# EAGLE board TiNRS&Navenant-Overstuurd versie 1 (EAGLE 9.5.1), part 1 of 3
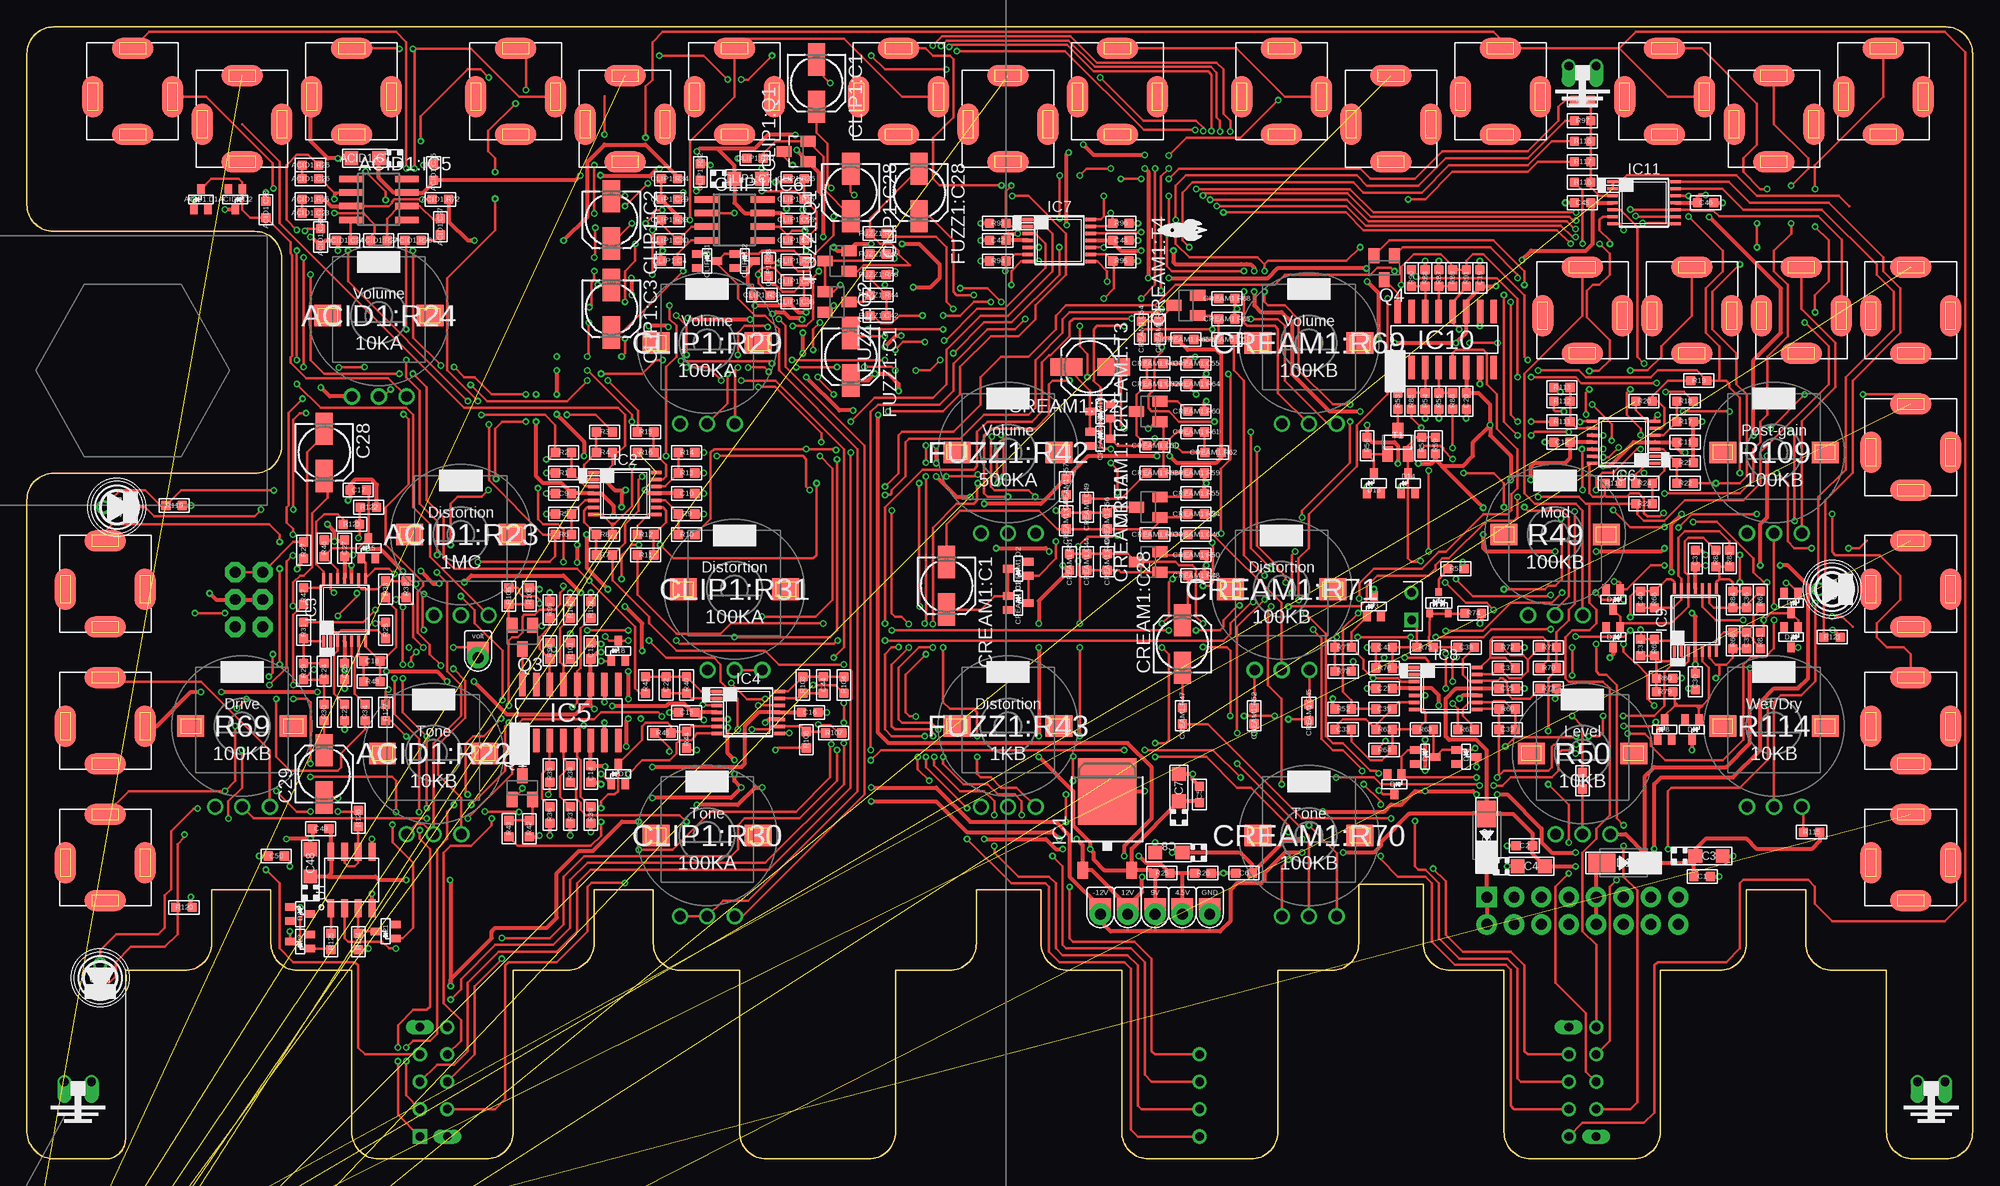
[diagram p11: board, top side]
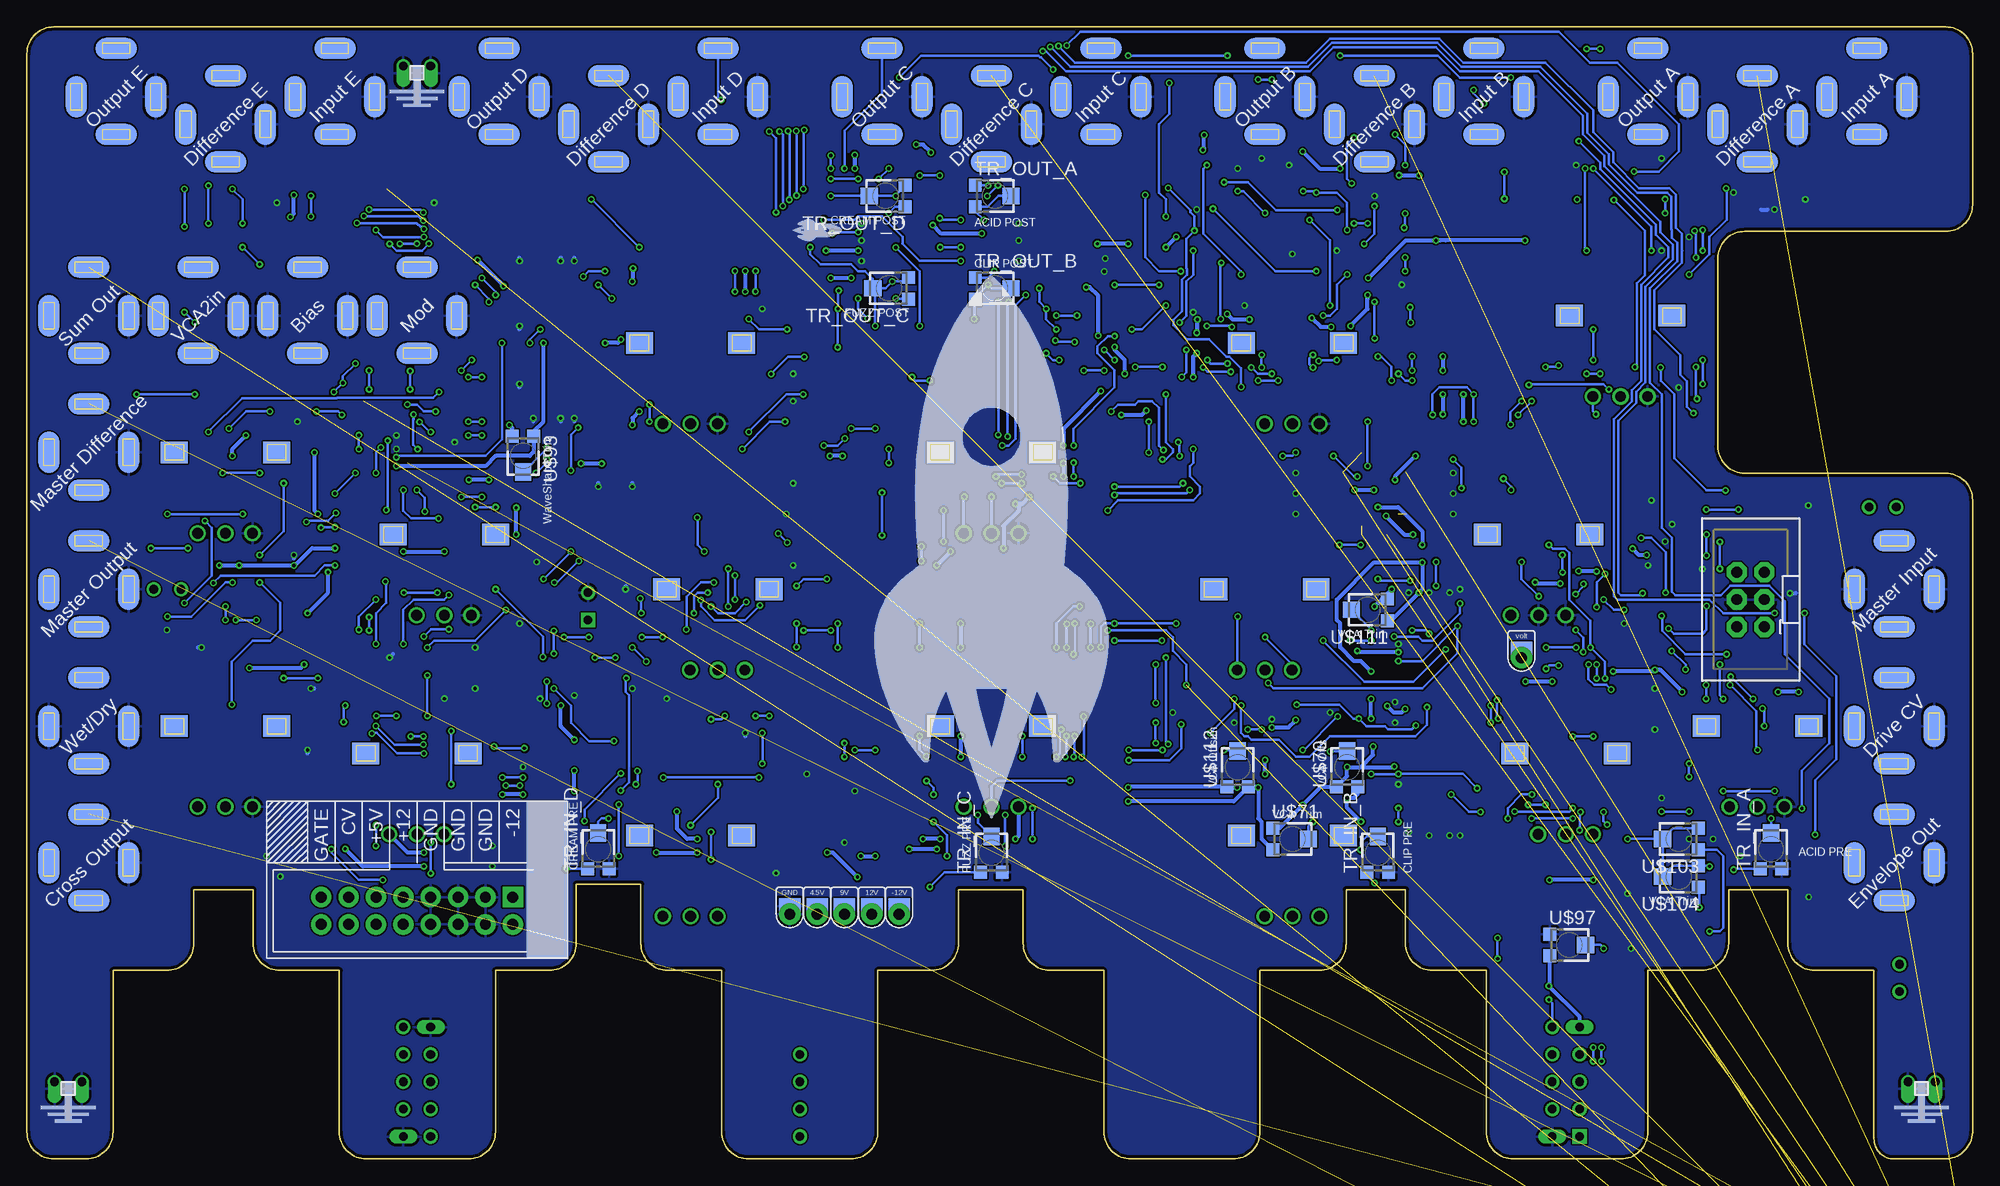
[diagram p12: board, bottom side, seen from below]

Size 180.66 x 105.08 mm. Coordinates in mm from the lower left corner, seen from the top.
Copper layers (1*16): Top 0.035mm / dielectric 1.5mm / Bottom 0.035mm
Design rules "ITeadstudio": minimum track width 6mil, minimum drill 12mil, track to track 6mil, track to pad 6mil, pad to pad 6mil, via to via 6mil, smd to smd 0mil, copper to edge 10mil, drill to drill 10mil, minimum pad ring 10mil, minimum via ring 6mil, stop-mask expansion 2mil, vias tented up to drill 100mil, thermal gap 10mil
Net classes: 0 default: width 0.254 mm; 1 power: width 0.381 mm

## Footprints (pad centres in the part's own frame; a part is rotated, then mirrored left to right if it is on the bottom)
CASE-A_3216 = smd 1.27 x 1.27: + -1.27,0; - 1.27,0
C0603 = smd 0.889 x 0.889: 1 -0.762,0; 2 0.762,0
SOT-323 = smd 0.7 x 0.9: ANODE -0.65,-0.95; CATHODE 0,0.95; NC 0.65,-0.95
SO08 = smd 0.6 x 2.2: 1 -1.905,-2.6; 2 -0.635,-2.6; 3 0.635,-2.6; 4 1.905,-2.6; 5 1.905,2.6; 6 0.635,2.6; 7 -0.635,2.6; 8 -1.905,2.6
ALPS_POT_SQUAREHOLES = drill 1: P$1 -2.5,-7.5; P$2 0,-7.5; P$3 2.58,-7.5 | smd 2.5 x 2: P$4 -4.75,0; P$5 4.75,0 | smd 2.5 x 2 bottom: P$6 -4.75,0; P$7 4.75,0
R0603 = smd 0.889 x 0.889: 1 -0.762,0; 2 0.762,0
153CLV-0505 = smd 3 x 1.6: + 2.2,0; - -2.2,0
SOT23 = smd 1 x 1.4: 1 -0.95,-1.1; 2 0.95,-1.1; 3 0,1.1
SOT23-BEC = smd 1 x 1.4: B -0.95,-1.1; C 0,1.1; E 0.95,-1.1
DO-214AC = smd 2.5 x 1.7: 1 -2,0; 2 2,0
3MMLED = drill 0.8: + -1.27,0; - 1.27,0
TO252 = smd 1 x 1.6: 1 -2.28,-4.8; 2 2.28,-4.8 | smd 5.4 x 6.2: 3 0,2.5
TSSOP14 = smd 0.305 x 0.991: 1 -1.95,-2.918; 2 -1.3,-2.918; 3 -0.65,-2.918; 4 0,-2.918; 5 0.65,-2.918; 6 1.3,-2.918; 7 1.95,-2.918; 8 1.95,2.918; 9 1.3,2.918; 10 0.65,2.918; 11 0,2.918; 12 -0.65,2.918; 13 -1.3,2.918; 14 -1.95,2.918
SO16 = smd 0.6 x 2.2: 1 -4.445,-2.6; 2 -3.175,-2.6; 3 -1.905,-2.6; 4 -0.635,-2.6; 5 0.635,-2.6; 6 1.905,-2.6; 7 3.175,-2.6; 8 4.445,-2.6; 9 4.445,2.6; 10 3.175,2.6; 11 1.905,2.6; 12 0.635,2.6; 13 -0.635,2.6; 14 -1.905,2.6; 15 -3.175,2.6; 16 -4.445,2.6
3.5MM-JACK-SWITCH-13MM-NOHOLES = smd 1.95 x 3.85 bottom: RING_B@1 -3.7,0; SWITCH_B@1 3.7,0 | smd 1.95 x 3.85: RING_T@3 -3.7,0; SWITCH_T@3 3.7,0 | smd 3.85 x 1.95 bottom: SECOND_B@1 0,-3.5; TIP_B@1 0,4.5 | smd 3.85 x 1.95: SECOND_T@3 0,-3.5; TIP_T@3 0,4.5
POWER_16_SHROUDED = drill 1.016 pad 1.88 square: 1 -8.89,-1.27 | drill 1.016 pad 1.88: 2 -8.89,1.27; 3 -6.35,-1.27; 4 -6.35,1.27; 5 -3.81,-1.27; 6 -3.81,1.27; 7 -1.27,-1.27; 8 -1.27,1.27; 9 1.27,-1.27; 10 1.27,1.27; 11 3.81,-1.27; 12 3.81,1.27; 13 6.35,-1.27; 14 6.35,1.27; 15 8.89,-1.27; 16 8.89,1.27
TC33X = smd 1.2 x 1.2: 1 -1,-1.825; 3 1,-1.825 | smd 1.5 x 1.6: 2 0,1.5
SOIC8 = smd 1.651 x 0.635: 1 -2.616,1.905; 2 -2.616,0.635; 3 -2.616,-0.635; 4 -2.616,-1.905; 5 2.616,-1.905; 6 2.616,-0.635; 7 2.616,0.635; 8 2.616,1.905
POWERTESTPAD = drill 1 pad 2: P$1 0,0 | smd 2 x 1.5: P$2 0,-0.75 | smd 2 x 1.5 bottom: P$3 0,-0.75
BYPASSBOARD = drill 0.8 long: 12V 31.75,15.24; GND 34.29,5.08; GND2 138.43,15.24; GND3 140.97,5.08 | drill 0.8 square: P$1 31.75,5.08 | drill 0.8: P$2 31.75,10.16; P$3 31.75,7.62; P$4 31.75,12.7; P$5 34.29,15.24; P$6 34.29,10.16; P$7 34.29,12.7; P$8 34.29,7.62; P$9 104.14,5.08; P$10 104.14,10.16; P$11 104.14,7.62; P$12 104.14,12.7; P$13 138.43,5.08; P$14 138.43,10.16; P$15 138.43,7.62; P$16 138.43,12.7; P$17 140.97,15.24; P$18 140.97,10.16; P$19 140.97,12.7; P$20 140.97,7.62
GROUNDLOOP = drill 0.8 offset: P$1 1.27,0; P$2 -1.27,0
2X3-SHROUDED = drill 1.016 pad 1.88 octagon: 1 -1.27,2.54; 2 1.27,2.54; 3 -1.27,0; 4 1.27,0; 5 -1.27,-2.54; 6 1.27,-2.54
SOT23' = smd 0.6 x 0.7: P$1 -0.85,-1; P$2 0.85,-1; P$3 0,1
TESTPAD_DUAL_PTH = drill 0.8 square: P$1 -1.27,0 | drill 0.8: P$2 1.27,0

## Placement (x,y rotation side)
ACID1:C7  10uF  [CASE-A_3216]  31.41,92.89 180 top
ACID1:C22  1nF  [C0603]  27.28,85.58 270 top
ACID1:C23  10nF  [C0603]  26.33,87.81 180 top
ACID1:C24  100n  [C0603]  29.5,85.27 180 top
ACID1:C25  100n  [C0603]  37.76,91.61 90 top
ACID1:C26  47nF  [C0603]  26.33,90.98 0 top
ACID1:C27  1uF  [C0603]  38.39,86.53 270 top
ACID1:C28  1nF  [C0603]  22.2,88.12 270 top
ACID1:D1  BAS16W  [SOT-323]  16.17,89.08 0 top
ACID1:D2  BAS16W  [SOT-323]  19.34,89.08 180 top
ACID1:IC5  UA741D  [SO08]  32.68,89.08 270 top
ACID1:R22  10KB  [ALPS_POT_SQUAREHOLES]  37.76,37.64 0 top
ACID1:R23  1MC  [ALPS_POT_SQUAREHOLES]  40.3,57.96 0 top
ACID1:R24  10KA  [ALPS_POT_SQUAREHOLES]  32.68,78.28 0 top
ACID1:R25  10K  [R0603]  26.33,89.08 180 top
ACID1:R26  4.7K  [R0603]  26.33,92.25 0 top
ACID1:R27  1M  [R0603]  32.68,85.27 0 top
ACID1:R28  5.6K  [R0603]  35.85,85.27 0 top
ACID1:R72  1M  [R0603]  38.39,89.08 0 top
C1  100n  [C0603]  155.55,26.21 180 top
C2  100n  [C0603]  139.04,29.07 180 top
C3  10u  [CASE-A_3216]  156.18,28.11 0 top
C4  10u  [CASE-A_3216]  139.67,27.16 0 top
C5  100n  [C0603]  108.88,33.83 270 top
C6  100n  [C0603]  113,26.53 0 top
C7  10u  [CASE-A_3216]  106.97,34.47 90 top
C8  10u  [CASE-A_3216]  106.02,28.43 180 top
C9  100n  [C0603]  49.82,61.77 0 top
C10  100n  [C0603]  61.25,61.77 0 top
C11  100n  [C0603]  153.96,66.53 180 top
C12  100n  [C0603]  142.53,66.53 180 top
C13  100n  [C0603]  52.36,47.16 270 top
C14  100n  [C0603]  52.36,35.73 270 top
C15  100n  [C0603]  61.25,41.45 0 top
C16  100n  [C0603]  72.68,41.45 0 top
C17  100nF  [C0603]  30.77,62.09 0 top
C18  10pF  [C0603]  32.04,46.21 0 top
C19  100n  [C0603]  134.91,81.77 270 top
C20  100n  [C0603]  133.64,70.34 270 top
C21  100n  [C0603]  126.02,43.67 0 top
C22  10pF  [C0603]  59.35,43.99 90 top
C23  10pF  [C0603]  29.5,41.45 90 top
C24  47pF  [C0603]  27.6,45.26 270 top
C25  100n  [C0603]  137.45,43.67 0 top
C26  100n  [C0603]  29.5,45.26 90 top
C27  100n  [C0603]  29.5,56.69 90 top
C28  10uF  [153CLV-0505]  27.6,65.58 270 top
C29  10uF  [153CLV-0505]  27.6,35.73 90 top
C30  100n  [C0603]  154.91,44.31 90 top
C31  100n  [C0603]  154.91,55.74 90 top
C32  33p  [C0603]  137.45,39.86 0 top
C33  220p  [C0603]  122.21,39.86 180 top
C34  33p  [C0603]  149.83,47.48 90 top
C35  33p  [C0603]  159.68,48.12 270 top
C36  33p  [C0603]  159.68,51.93 270 top
C37  33p  [C0603]  137.45,45.58 180 top
C38  100n  [C0603]  133.64,47.48 180 top
C39  680n  [C0603]  126.02,41.77 0 top
C40  33p FIX  [C0603]  149.83,51.93 270 top
C41  33p FIX  [C0603]  126.02,47.48 180 top
C42  100n  [C0603]  90.14,85.27 0 top
C43  100n  [C0603]  101.57,85.27 0 top
C44  10pF  [C0603]  73.95,43.99 90 top
C45  100n  [C0603]  144.44,88.76 0 top
C46  100n  [C0603]  155.87,88.76 0 top
C48  10u  [CASE-A_3216]  26.33,27.48 90 top
C49  100n  [C0603]  27.28,30.66 0 top
C50  22uF  [C0603]  23.15,28.11 0 top
CLIP1:C1  4.7uF  [153CLV-0505]  73.32,99.87 270 top
CLIP1:C2  2.2uF  [153CLV-0505]  54.27,87.17 270 top
CLIP1:C3  4.7uF  [153CLV-0505]  54.27,78.92 270 top
CLIP1:C4  100n  [C0603]  59.66,83.36 180 top
CLIP1:C7  10uF  [CASE-A_3216]  66.97,90.98 0 top
CLIP1:C25  100n  [C0603]  71.41,87.17 0 top
CLIP1:C28  1uF  [153CLV-0505]  76.49,89.71 270 top
CLIP1:C29  22nF  [C0603]  59.66,89.08 180 top
CLIP1:C30  1nF  [C0603]  59.66,85.27 0 top
CLIP1:C31  100pF  [C0603]  71.41,85.27 180 top
CLIP1:C35  3.3nF  [C0603]  71.41,79.55 180 top
CLIP1:C36  22nF  [C0603]  71.41,81.45 180 top
CLIP1:D1  BAS16W  [SOT-323]  63.16,83.36 270 top
CLIP1:D2  BAS16W  [SOT-323]  66.65,83.36 270 top
CLIP1:IC6  UA741D  [SO08]  65.7,87.17 270 top
CLIP1:Q1  SST201  [SOT23]  71.41,93.52 90 top
CLIP1:R29  100KA  [ALPS_POT_SQUAREHOLES]  63.16,75.74 0 top
CLIP1:R30  100KA  [ALPS_POT_SQUAREHOLES]  63.16,30.02 0 top
CLIP1:R31  100KA  [ALPS_POT_SQUAREHOLES]  65.7,52.88 0 top
CLIP1:R32  1M  [R0603]  62.52,91.61 90 top
CLIP1:R33  1K  [R0603]  59.66,87.17 180 top
CLIP1:R34  1M  [R0603]  59.66,90.98 0 top
CLIP1:R35  560R  [R0603]  71.41,89.08 0 top
CLIP1:R36  47R  [R0603]  71.41,90.98 0 top
CLIP1:R37  1K  [R0603]  71.41,83.36 0 top
CLIP1:R38  1.5K  [R0603]  68.87,82.72 270 top
CLIP1:R39  1M  [R0603]  68.24,80.19 0 top
CLIP1:R40  10K  [R0603]  67.6,92.89 0 top
CREAM1:C1  1uF  [153CLV-0505]  85.38,53.2 270 top
CREAM1:C2  1uF  [153CLV-0505]  98.72,73.52 180 top
CREAM1:C28  1uF  [153CLV-0505]  107.29,47.8 90 top
CREAM1:C44  470pF  [C0603]  98.4,55.42 90 top
CREAM1:C45  1uF  [C0603]  119.04,41.45 90 top
CREAM1:C46  100nF  [C0603]  108.56,57.96 180 top
CREAM1:C47  470pF  [C0603]  96.49,59.23 90 top
CREAM1:C49  100nF  [C0603]  98.4,60.5 90 top
CREAM1:C50  470pF  [C0603]  104.75,66.22 180 top
CREAM1:C52  4nF  [C0603]  104.75,71.93 0 top
CREAM1:C53  100nF  [C0603]  111.42,76.06 180 top
CREAM1:C54  100nF  [C0603]  103.48,77.01 270 top
CREAM1:C55  10nF  [C0603]  108.56,73.83 180 top
CREAM1:D1  BAS16W  [SOT-323]  92.05,51.61 270 top
CREAM1:D2  BAS16W  [SOT-323]  92.05,54.78 90 top
CREAM1:D3  BAS16W  [SOT-323]  99.67,69.39 90 top
CREAM1:D4  BAS16W  [SOT-323]  99.67,66.85 270 top
CREAM1:R47  39K  [R0603]  107.29,41.13 90 top
CREAM1:R48  47K  [R0603]  108.56,54.15 180 top
CREAM1:R49  470K  [R0603]  100.3,55.42 270 top
CREAM1:R50  100R  [R0603]  108.56,56.05 0 top
CREAM1:R51  10K  [R0603]  96.81,55.42 90 top
CREAM1:R52  1K  [R0603]  113.96,41.13 270 top
CREAM1:R53  10K  [R0603]  104.75,57.96 180 top
CREAM1:R54  100K  [R0603]  108.56,59.87 180 top
CREAM1:R55  150R  [R0603]  108.56,61.77 180 top
CREAM1:R56  470K  [R0603]  100.3,59.23 270 top
CREAM1:R57  10K  [R0603]  96.49,62.41 270 top
CREAM1:R58  10K  [R0603]  104.75,63.67 0 top
CREAM1:R59  100K  [R0603]  108.56,63.67 180 top
CREAM1:R60  150R  [R0603]  108.56,69.39 180 top
CREAM1:R61  470K  [R0603]  108.56,67.48 180 top
CREAM1:R62  10K  [R0603]  110.15,65.58 180 top
CREAM1:R63  39K  [R0603]  104.75,73.83 0 top
CREAM1:R64  22K  [R0603]  108.56,71.93 0 top
CREAM1:R65  100K  [R0603]  111.42,77.96 180 top
CREAM1:R66  430K  [R0603]  107.61,76.06 180 top
CREAM1:R67  15K  [R0603]  105.07,77.01 270 top
CREAM1:R68  3.3K  [R0603]  111.42,79.87 180 top
CREAM1:R69  100KB  [ALPS_POT_SQUAREHOLES]  119.04,75.74 0 top
CREAM1:R70  100KB  [ALPS_POT_SQUAREHOLES]  119.04,30.02 0 top
CREAM1:R71  100KB  [ALPS_POT_SQUAREHOLES]  116.5,52.88 0 top
CREAM1:T1  2n3904  [SOT23-BEC]  104.11,55.42 90 top
CREAM1:T2  2n3904  [SOT23-BEC]  104.11,60.5 90 top
CREAM1:T3  2n3904  [SOT23-BEC]  104.11,69.39 90 top
CREAM1:T4  2n3904  [SOT23-BEC]  107.61,79.23 90 top
D1  1n4001  [DO-214AC]  148.25,27.48 0 top
D2  1n4001  [DO-214AC]  135.55,30.02 270 top
D3  BAS16W  [SOT-323]  125.07,51.29 0 top
D4  BAS16W  [SOT-323]  126.97,34.78 180 top
D5  BAS16W  [SOT-323]  133.64,37.32 270 top
D6  BAS16W  [SOT-323]  129.83,37.32 270 top
D7  BAS16W  [SOT-323]  154.6,39.86 180 top
D8  BAS16W  [SOT-323]  152.06,39.86 0 top
D9  BAS16W  [SOT-323]  163.8,51.61 180 top
D10  BAS16W  [SOT-323]  147.29,51.93 180 top
D11  BAS16W  [SOT-323]  147.29,48.44 180 top
D12  BAS16W  [SOT-323]  163.8,48.44 180 top
D13  BAS16W  [SOT-323]  125.07,62.72 0 top
D14  BAS16W  [SOT-323]  128.24,62.72 0 top
D15  BAS16W  [SOT-323]  31.72,56.69 0 top
D16  [3MMLED]  8.36,60.5 0 top
D17  BAS16W  [SOT-323]  54.9,35.73 0 top
D18  BAS16W  [SOT-323]  54.9,47.16 0 top
D19  [3MMLED]  6.8,16.8 270 top
D20  [3MMLED]  167.61,52.88 0 top
D21  BAS16W  [SOT-323]  33.31,21.13 90 top
D22  BAS16W  [SOT-323]  25.37,20.18 90 top
D23  BAS16W  [SOT-323]  25.37,22.72 270 top
FUZZ1:C1  20uF  [153CLV-0505]  76.49,74.47 270 top
FUZZ1:C28  2.2uF  [153CLV-0505]  82.84,89.71 270 top
FUZZ1:C42  10nF  [C0603]  79.03,78.28 180 top
FUZZ1:Q1  MMBT3906LT1SMD  [SOT23-BEC]  75.22,83.36 90 top
FUZZ1:Q2  MMBT3906LT1SMD  [SOT23-BEC]  75.22,79.55 270 top
FUZZ1:R41  100K  [R0603]  79.03,85.9 180 top
FUZZ1:R42  500KA  [ALPS_POT_SQUAREHOLES]  91.1,65.58 0 top
FUZZ1:R43  1KB  [ALPS_POT_SQUAREHOLES]  91.1,40.18 0 top
FUZZ1:R44  8.2K  [R0603]  79.03,80.19 180 top
FUZZ1:R45  33K  [R0603]  79.03,84 180 top
FUZZ1:R46  470R  [R0603]  79.03,82.09 180 top
IC1  7809DT  [TO252]  100.3,31.61 0 top
IC2  TL074TSSOP14  [TSSOP14]  55.54,61.77 270 top
IC3  TL074TSSOP14  [TSSOP14]  29.5,50.98 0 top
IC4  TL074TSSOP14  [TSSOP14]  66.97,41.45 270 top
IC5  LM13700M  [SO16]  50.46,41.45 0 top
IC6  TL074TSSOP14  [TSSOP14]  148.25,66.53 90 top
IC7  TL074TSSOP14  [TSSOP14]  95.86,85.27 270 top
IC8  TL074TSSOP14  [TSSOP14]  131.74,43.67 270 top
IC9  TL074TSSOP14  [TSSOP14]  154.91,50.02 0 top
IC10  LM13700M  [SO16]  131.74,76.06 0 top
IC11  TL074TSSOP14  [TSSOP14]  150.15,88.76 270 top
J1  JACK  [3.5MM-JACK-SWITCH-13MM-NOHOLES]  164.76,78.28 0 top
J2  POWERSHROUDED  [POWER_16_SHROUDED]  144.44,23.04 180 bottom
J3  JACK  [3.5MM-JACK-SWITCH-13MM-NOHOLES]  174.92,52.88 0 top
J4  JACK  [3.5MM-JACK-SWITCH-13MM-NOHOLES]  45.38,98.6 0 top
J5  JACK  [3.5MM-JACK-SWITCH-13MM-NOHOLES]  55.54,96.06 0 top
J6  JACK  [3.5MM-JACK-SWITCH-13MM-NOHOLES]  9.82,98.6 0 top
J7  JACK  [3.5MM-JACK-SWITCH-13MM-NOHOLES]  30.14,98.6 0 top
J8  JACK  [3.5MM-JACK-SWITCH-13MM-NOHOLES]  19.98,96.06 0 top
J9  JACK  [3.5MM-JACK-SWITCH-13MM-NOHOLES]  65.7,98.6 0 top
J10  JACK  [3.5MM-JACK-SWITCH-13MM-NOHOLES]  174.92,65.58 0 top
J11  JACK  [3.5MM-JACK-SWITCH-13MM-NOHOLES]  80.94,98.6 0 top
J12  JACK  [3.5MM-JACK-SWITCH-13MM-NOHOLES]  91.1,96.06 0 top
J13  JACK  [3.5MM-JACK-SWITCH-13MM-NOHOLES]  101.26,98.6 0 top
J14  JACK  [3.5MM-JACK-SWITCH-13MM-NOHOLES]  116.5,98.6 0 top
J15  JACK  [3.5MM-JACK-SWITCH-13MM-NOHOLES]  126.66,96.06 0 top
J16  JACK  [3.5MM-JACK-SWITCH-13MM-NOHOLES]  136.82,98.6 0 top
J17  JACK  [3.5MM-JACK-SWITCH-13MM-NOHOLES]  152.06,98.6 0 top
J18  JACK  [3.5MM-JACK-SWITCH-13MM-NOHOLES]  162.22,96.06 0 top
J19  JACK  [3.5MM-JACK-SWITCH-13MM-NOHOLES]  172.38,98.6 0 top
J20  JACK  [3.5MM-JACK-SWITCH-13MM-NOHOLES]  7.28,52.88 0 top
J21  JACK  [3.5MM-JACK-SWITCH-13MM-NOHOLES]  7.28,40.18 0 top
J22  JACK  [3.5MM-JACK-SWITCH-13MM-NOHOLES]  144.44,78.28 0 top
J23  JACK  [3.5MM-JACK-SWITCH-13MM-NOHOLES]  154.6,78.28 0 top
J24  JACK  [3.5MM-JACK-SWITCH-13MM-NOHOLES]  7.28,27.48 0 top
J25  JACK  [3.5MM-JACK-SWITCH-13MM-NOHOLES]  174.92,40.18 0 top
J26  JACK  [3.5MM-JACK-SWITCH-13MM-NOHOLES]  174.92,27.48 0 top
J27  JACK  [3.5MM-JACK-SWITCH-13MM-NOHOLES]  174.92,78.28 0 top
PCB1  EURORACK_PCB5STOMP  [EURORACK36HP_5STOMP]  -0.34,-3 0 top
Q1  MMBT3906LT1SMD  [SOT23-BEC]  46.01,34.47 0 top
Q3  MMBT3906LT1SMD  [SOT23-BEC]  46.01,48.44 180 top
Q4  MMBT3906LT1SMD  [SOT23-BEC]  126.02,82.72 180 top
R1  100k  [R0603]  49.82,63.67 180 top
R2  100k  [R0603]  49.82,65.58 180 top
R3  100k  [R0603]  53.63,67.48 0 top
R4  100k  [R0603]  53.63,65.58 180 top
R5  100k  [R0603]  49.82,59.87 180 top
R6  100k  [R0603]  49.82,57.96 180 top
R7  100k  [R0603]  53.63,56.05 0 top
R8  100k  [R0603]  53.63,57.96 180 top
R9  100k  [R0603]  61.25,59.87 0 top
R10  100k  [R0603]  61.25,57.96 0 top
R11  100k  [R0603]  57.44,56.05 180 top
R12  100k  [R0603]  57.44,57.96 0 top
R13  100k  [R0603]  61.25,63.67 0 top
R14  100k  [R0603]  61.25,65.58 0 top
R15  100k  [R0603]  57.44,67.48 180 top
R16  100k  [R0603]  57.44,65.58 0 top
R17  100k  [R0603]  153.96,68.44 0 top
R18  100k  [R0603]  153.96,70.34 0 top
R19  100k  [R0603]  155.23,72.25 0 top
R20  100k  [R0603]  150.15,70.34 0 top
R21  100k  [R0603]  153.96,64.63 0 top
R22  100k  [R0603]  153.96,62.72 0 top
R23  100k  [R0603]  150.15,60.82 180 top
R24  100k  [R0603]  150.15,62.72 0 top
R25  100k  [R0603]  105.38,26.53 180 top
R26  100k  [R0603]  109.19,26.53 180 top
R27  1M  [R0603]  25.69,56.5 90 top
R28  150K  [R0603]  33.31,49.07 270 top
R29  10K  [R0603]  25.69,45.26 90 top
R30  470R  [R0603]  27.6,41.45 90 top
R31  1K  [R0603]  25.69,49.07 90 top
R32  100K  [R0603]  35.22,52.88 270 top
R33  100K  [R0603]  33.31,52.88 270 top
R34  100k  [R0603]  31.41,41.45 90 top
R35  4.7K  [R0603]  48.55,35.73 90 top
R36  10R  [R0603]  48.55,31.92 90 top
R37  10R  [R0603]  50.46,31.92 270 top
R38  100K  [R0603]  50.46,35.73 270 top
R39  100K  [R0603]  52.36,31.92 270 top
R40  100K  [R0603]  61.25,43.99 90 top
R41  1K  [R0603]  57.44,43.99 270 top
R42  10K  [R0603]  46.65,30.66 90 top
R43  100K  [R0603]  44.74,30.66 90 top
R44  100K  [R0603]  61.25,38.91 90 top
R45  330K  [R0603]  59.03,39.55 0 top
R46  30K  [R0603]  27.6,56.69 270 top
R47  1K  [R0603]  25.69,52.24 90 top
R48  100k  [R0603]  32.04,44.31 0 top
R49  100KB  [ALPS_POT_SQUAREHOLES]  141.9,57.96 0 top
R50  10KB  [ALPS_POT_SQUAREHOLES]  144.44,37.64 0 top
R51  14  [R0603]  132.69,54.78 0 top
R52  470K  [R0603]  122.21,41.77 180 top
R53  4K7  [R0603]  127.29,70.34 90 top
R54  100  [R0603]  129.83,70.34 90 top
R55  100  [R0603]  131.1,70.34 90 top
R56  470K  [R0603]  124.43,66.22 90 top
R57  22K  [R0603]  129.51,66.22 270 top
R58  33K  [R0603]  144.44,35.1 270 top
R59  4M7  [R0603]  130.78,66.22 90 top
R60  10K  [R0603]  137.45,41.77 0 top
R61  47K  [R0603]  133.64,39.86 180 top
R62  33K  [R0603]  126.02,39.86 180 top
R63  33K  [R0603]  129.83,39.86 180 top
R64  100K  [R0603]  126.02,37.96 0 top
R65  100K  [R0603]  151.1,47.48 90 top
R66  100K  [R0603]  158.41,48.12 270 top
R67  100K  [R0603]  160.95,51.93 270 top
R68  100K  [R0603]  151.1,51.93 270 top
R69  100KB  [ALPS_POT_SQUAREHOLES]  19.98,40.18 0 top
R70  100  [R0603]  141.26,45.58 180 top
R71  100K  [R0603]  141.26,47.48 180 top
R72  10K  [R0603]  137.45,47.48 0 top
R73  220K  [R0603]  141.26,43.67 180 top
R74  10K  [R0603]  134.28,50.66 180 top
R75  6K8  [R0603]  129.83,47.48 0 top
R76  100K  [R0603]  126.02,45.58 0 top
R77  33K  [R0603]  122.21,47.48 0 top
R78  100K  [R0603]  122.21,45.26 0 top
R79  33K  [R0603]  152.06,43.35 180 top
R80  100K  [R0603]  152.06,44.62 180 top
R81  33K  [R0603]  160.95,48.12 270 top
R82  33K  [R0603]  156.82,55.74 270 top
R83  100K  [R0603]  158.09,55.74 270 top
R84  100K  [R0603]  158.41,51.93 270 top
R85  27k  [R0603]  128.56,70.34 270 top
R86  150k  [R0603]  132.37,70.34 270 top
R87  1k  [R0603]  131.1,81.77 270 top
R88  1k  [R0603]  129.83,81.77 270 top
R89  200k  [R0603]  132.37,81.77 90 top
R90  200k  [R0603]  128.56,81.77 90 top
R91  47k  [R0603]  133.64,81.77 270 top
R92  100K  [R0603]  144.44,98.28 0 top
R93  4.7k  [R0603]  90.14,86.85 180 top
R94  4.7k  [R0603]  90.14,83.36 180 top
R95  4.7k  [R0603]  101.57,83.36 0 top
R96  4.7k  [R0603]  101.57,86.85 0 top
R97  100K  [R0603]  144.44,96.38 0 top
R98  4.7K  [R0603]  48.55,47.16 270 top
R99  10R  [R0603]  48.55,50.98 270 top
R100  10R  [R0603]  50.46,50.98 90 top
R101  100K  [R0603]  50.46,47.16 90 top
R102  100K  [R0603]  52.36,50.98 90 top
R103  100K  [R0603]  72.05,43.99 90 top
R104  1K  [R0603]  75.86,43.99 270 top
R105  10K  [R0603]  46.65,52.24 270 top
R106  100K  [R0603]  44.74,52.24 270 top
R107  100K  [R0603]  74.9,39.55 180 top
R108  330K  [R0603]  72.36,38.91 90 top
R109  100KB  [ALPS_POT_SQUAREHOLES]  162.22,65.58 0 top
R110  47k  [R0603]  147.29,62.72 0 top
R111  2.2k  [R0603]  142.53,68.44 0 top
R112  18k  [R0603]  142.53,70.34 180 top
R113  18k  [R0603]  142.53,71.61 180 top
R114  10KB  [ALPS_POT_SQUAREHOLES]  162.22,40.18 0 top
R115  14k  [R0603]  165.71,30.34 180 top
R116  100K  [R0603]  144.44,94.47 0 top
R117  100K  [R0603]  144.44,92.57 0 top
R118  100K  [R0603]  144.44,90.66 0 top
R119  1.2K  [R0603]  13.66,60.65 180 top
R120  1.2K  [R0603]  14.58,23.35 180 top
R121  1.2K  [R0603]  167.61,48.44 180 top
R122  10K  [R0603]  31.72,60.5 0 top
R123  15K  [R0603]  30.14,58.91 180 top
R124  100K  [R0603]  30.77,20.18 270 top
R125  560 (33)R  [R0603]  28.23,20.18 270 top
R126  1K  [R0603]  30.77,31.61 270 top
R127  100K  [R0603]  33.31,41.45 90 top
R128  56  [R0603]  -0.66,-14.75 0 top  (outside the outline)
R129  56  [R0603]  -0.66,-17.29 0 top  (outside the outline)
R130  56  [R0603]  -0.66,-19.83 0 top  (outside the outline)
R131  56  [R0603]  -0.66,-22.37 0 top  (outside the outline)
R132  56  [R0603]  -0.66,-24.91 0 top  (outside the outline)
R133  56  [R0603]  -0.66,-27.45 0 top  (outside the outline)
R134  56  [R0603]  -0.66,-29.99 0 top  (outside the outline)
R135  56  [R0603]  -0.66,-32.53 0 top  (outside the outline)
T1  3906  [SOT23-BEC]  127.29,66.53 0 top
TR_IN_A  50k  [TC33X]  18.71,28.75 0 bottom
TR_IN_B  50k  [TC33X]  55.22,28.43 0 bottom
TR_IN_C  50k  [TC33X]  91.1,28.43 0 bottom
TR_IN_D  50k  [TC33X]  127.61,28.75 0 bottom
TR_OUT_A  50k  [TC33X]  90.78,89.39 270 bottom
TR_OUT_B  50k  [TC33X]  90.78,80.82 270 bottom
TR_OUT_C  50k  [TC33X]  100.62,80.82 90 bottom
TR_OUT_D  50k  [TC33X]  100.94,89.39 90 bottom
U1  LM358DR-1110010P1  [SOIC8]  30.14,25.89 90 top
U$13  VOLTAGETESTPAD  [POWERTESTPAD]  102.21,22.72 180 top
U$15  VOLTAGETESTPAD  [POWERTESTPAD]  41.88,46.53 180 top
U$22  5STOMPBOARD  [BYPASSBOARD]  4.74,-3 0 top
U$23  HEADPHONEHOLE_BIGGAP  [HEADPHONEHOLE_GAP]  9.82,73.2 180 top
U$41  VOLTAGETESTPAD  [POWERTESTPAD]  99.67,22.72 180 top
U$42  VOLTAGETESTPAD  [POWERTESTPAD]  104.75,22.72 180 top
U$43  VOLTAGETESTPAD  [POWERTESTPAD]  109.83,22.72 180 top
U$44  VOLTAGETESTPAD  [POWERTESTPAD]  107.29,22.72 180 top
U$48  GNDLOOP  [GROUNDLOOP]  176.82,7.16 0 top
U$49  GNDLOOP  [GROUNDLOOP]  144.44,101.46 0 top
U$50  GNDLOOP  [GROUNDLOOP]  4.74,7.16 0 top
U$68  HEADPHONE  [2X3-SHROUDED]  20.61,51.93 180 bottom
U$70  100k  [TC33X]  58.08,36.37 0 bottom
U$71  100k  [TC33X]  63.16,29.7 270 bottom
U$74  BAT54S  [SOT23']  131.1,51.61 0 top
U$92  TESTPOINT_DUAL_PTH  [TESTPAD_DUAL_PTH]  128.56,51.29 90 top
U$93  50K  [TC33X]  134.59,65.26 180 bottom
U$94  TINRS_ARTWORKTINYDATE  [JUSTATINYROCKET_DATECODE]  107.29,86.22 270 bottom
U$95  TINRS_ARTWORKTINYDATE  [JUSTATINYROCKET_DATECODE]  107.29,86.22 90 top
U$96  ROCKET-5CM  [ROCKET-5CM]  91.1,54.78 0 bottom
U$97  50k  [TC33X]  37.44,19.86 270 bottom
U$103  50k  [TC33X]  27.28,29.7 90 bottom
U$104  50k  [TC33X]  27.28,26.21 90 bottom
U$111  100k  [TC33X]  56.17,50.98 90 bottom
U$112  100k  [TC33X]  68.24,36.37 0 bottom

## Tracks (layer width: path | path; a pad name or v marks a point on that pad's centre or on a via)
4.5V  (via drill 0.3)
  Top 0.381: R26.2 107.29,26.53 | 107.29,26.53 R25.1 105.22,27.45 103.97,27.45 103.31,28.11 v103.23,28.11 | U$44.P$2 107.29,26.53 | ACID1:R72.2 39.15,87.84 39.18,87.82 39.18,87.02 40.93,85.27 v41.57,85.27 | v49.83,85.27 52.04,87.47 52.04,92.57 53.63,94.16 57.44,94.16 60.43,91.17 CLIP1:R34.2 | v101.89,28.11 101.89,29.07 104.44,31.62 104.44,36.36 102.21,38.59 79.98,38.59 79.03,39.55 v79.03,69.07 | v76.71,69.49 75.44,69.49 v72.36,72.56 | v72.05,74.79 v72.05,76.69 | v71.97,77.91 71.82,78.06 70.83,78.06 70.28,78.61 69.55,78.61 69.38,78.44 v69.22,78.44 | v67.14,77.91 61.49,77.91 v61.35,78.06 | v59.57,77.23 59.47,77.33 v57.76,77.33 | v56.17,80.19 56.17,81.72 v56.12,81.77
  Bottom 0.381: v41.57,85.27 48.9,85.27 48.92,85.28 49.45,85.28 49.47,85.27 v49.83,85.27 52.63,85.27 v56.12,81.77 | v103.23,28.11 v101.89,28.11 | v79.03,69.07 77.13,69.07 v76.71,69.49 | v72.36,72.56 72.36,74.47 v72.05,74.79 | v72.05,76.69 71.97,76.77 v71.97,77.91 | v61.35,78.06 60.52,77.23 v59.57,77.23 | v56.17,80.19 56.17,79.84 56.18,79.83 56.18,78.9 v57.76,77.33 | v69.22,78.44 68.69,77.91 v67.14,77.91
9V  (via drill 0.3)
  Top 0.381: CREAM1:R67.2 106.65,76.25 CREAM1:R66.2 107.8,75.11 110.46,75.11 110.91,74.66 CREAM1:R62.1 110.91,65.07 110.46,64.63 106.73,64.63 v106.09,65.26 | C5.2 108.75,33.2 C7.+ 102.58,28.81 IC1.2 | IC1.2 104.34,26.81 R25.2 104.75,26.4 U$42.P$2 | v73.94,85.6 73.94,89.4 73.48,89.86 73.48,91.6 CLIP1:Q1.1 71.47,93.61 v71.47,93.67 | v74.9,84.63 75.22,84.31 FUZZ1:Q1.E 76.96,84.95 v78.4,84.95 | v71.35,95.05 68.92,95.05 68.87,95.11 67.55,93.78 64.11,93.78 | v62.2,93.52 62.47,93.78 64.11,93.78 | v58.71,91.93 58.55,91.77 58.38,91.77 57.83,91.21 53.36,91.21 v53.26,91.31 | v51.4,91.3 50.91,90.81 50.87,90.85 ACID1:C25.1 37.76,90.66 36.8,89.71 ACID1:IC5.7 34.06,89.71 32.68,91.09 ACID1:C7.+ | v88.87,29.69 94.6,29.69 95.54,28.75 v96.16,28.75 | IC1.2 100.02,26.81 99.03,27.8 99.03,28.43 v98.72,28.75 98.72,29.38 97.13,30.97 97.13,34.15 v93.95,37.32 | v104.93,65.26 98.59,65.26 CREAM1:R57.1 94.14,60.82 v88.87,60.82 | v94.91,56.37 94.59,56.69 v89.99,56.69 | v96.18,55.1 96.62,54.66 CREAM1:R51.1 93.95,51.8 v93.95,49.7 | FUZZ1:C1.+ 78.1,72.27 v78.71,72.88 79.98,72.88 80.94,71.93 v80.94,71.3 | v79.67,75.37 80.71,76.42 v81.19,76.42 | v82.3,80.92 83.89,80.92 84.75,81.77 84.75,83.04 82.84,84.95 v81.25,84.95 | v84.43,66.22 v84.43,64.58 | v84.43,63.36 86.33,61.45 v87.6,61.45 | v93.95,47.48 v93.95,39.24 | CLIP1:C25.1 70.01,87.81 CLIP1:IC6.7 66.65,87.81 65.7,88.76 CLIP1:C7.+ 65.7,92.19 64.11,93.78
  Bottom 0.381: v73.94,85.6 v74.9,84.63 | v71.47,93.67 71.35,93.78 v71.35,95.05 | v62.2,93.52 60.62,91.93 v58.71,91.93 | v53.26,91.31 53.25,91.3 v51.4,91.3 | FUZZ1:R43.P$1 88.6,29.97 v88.87,29.69 | v96.16,28.75 v98.72,28.75 | v104.93,65.26 v106.09,65.26 | v94.91,56.37 v96.18,55.1 | v78.71,72.88 78.71,74.15 79.67,75.11 v79.67,75.37 | v81.19,76.42 81.19,76.58 81.18,76.59 81.18,80.11 81.98,80.92 v82.3,80.92 | v80.94,71.3 84.43,67.8 v84.43,66.22 | v84.43,64.58 v84.43,63.36 | v87.6,61.45 88.24,60.82 88.32,60.82 | 88.6,60.54 88.32,60.82 | 88.32,60.82 v88.87,60.82 88.6,60.54 | v93.95,49.7 v93.95,47.48 | v93.95,39.24 v93.95,37.32 | 88.6,60.54 88.6,60.14 89.99,58.75 v89.99,56.69 | v78.4,84.95 v81.25,84.95
12V  (via drill 0.3)
  Top 0.381: IC4.4 C15.2 | IC7.4 C42.2 90.9,85.71 91.1,85.9 v91.99,85.9 | C21.2 IC8.4 129.55,43.67 129.56,43.69 130.45,43.69 131.09,43.05 v131.09,42.09 | C1.2 154.79,27.48 | 154.79,27.48 154.79,27.99 C3.+ 154.91,28.75 155.87,29.7 159.68,29.7 160.63,28.75 165.71,28.75 166.47,29.51 R115.1 | v103.54,26.16 103.54,24.8 U$13.P$2 98.87,26.81 IC1.1 98.02,29.14 v97.46,29.7 | IC3.4 C26.2 v29.5,45.4 | IC9.4 v154.91,45.9 | D1.2 154.79,27.48 | D1.2 150.25,28.34 148.44,30.14 R50.P$3 | J21.SWITCH_T@3 12.04,40.18 15.21,43.35 v16.17,43.35 | v18.07,43.35 v26.96,43.35 | v33.39,45.26 38.07,45.26 v39.03,44.31 | v41.51,44.31 44.54,41.28 50.93,41.28 51.73,42.09 | 51.73,42.09 52.04,42.4 | 52.04,42.4 52.36,42.72 | 52.36,42.72 IC5.11 C13.2 53,47.04 v53.31,47.04 | v57.12,47.16 57.12,49.7 v55.54,51.29 | v47.28,68.44 47.28,63.36 47.92,62.72 49.63,62.72 C9.2 IC2.4 53.31,61.77 54.46,60.63 v54.46,59.67 | C15.2 61.8,41.45 61.01,42.24 59.53,42.24 59.33,42.03 v54.34,42.03 | v52.68,41.77 52.36,42.09 | 52.36,42.09 52.36,42.72 | 52.36,42.09 52.04,42.4 | 52.36,42.09 51.73,42.09 | v58.08,33.51 65.38,33.51 v66.33,34.47 65.7,35.1 v65.7,35.72 | v65.7,37.02 65.06,37.65 v65.06,40.05 | v62.84,40.73 62.12,41.45 C15.2 | v51.97,57.96 51.97,54.86 v53.95,52.88 | v106.34,28.43 C8.+ 112.69,28.43 113.76,27.35 C6.2 116.94,29.7 v118.4,29.7 | v56.79,31.3 55.26,31.3 52.56,28.6 51.26,28.6 49.19,26.53 49.19,22.4 48.23,21.45 43.47,21.45 43.15,21.13 43.15,20.5 39.34,16.68 v39.34,16.05 39.34,25.84 v39.29,25.89 | v78.4,33.2 84.43,33.2 87.29,30.34 95.22,30.34 v95.86,29.7 | v120.31,32.24 126.02,32.24 126.66,32.88 127.61,32.88 128.88,34.15 v129.83,34.15 134.28,34.15 v134.59,33.83
  Top 0.381: v129.83,36.05 v129.83,38.91 | v96.54,86.67 96.54,93.25 v96.71,93.42 | v98.08,94.16 99.03,93.2 v103.8,93.2 | v103.8,91.93 104.11,91.61 v104.11,81.77 | v106.02,81.77 115.23,81.77 116.18,82.72 124.32,82.72 v124.37,82.67 | v124.43,81.45 125.49,80.39 v125.49,76.06 | v126.97,75.74 v132.69,75.74 133.64,76.69 IC10.11 133.64,79.55 134.91,80.82 C19.2 136.37,81.01 v136.4,81.04 | C45.2 145.39,88.76 | 145.39,88.76 IC11.4 | v138.82,83.46 139.67,84.31 144.75,84.31 145.39,84.95 145.39,88.76 | C30.2 v154.91,45.9 | v154.91,45.9 154.91,50.34 v154.6,50.66 | v152.69,54.47 152.69,58.91 v153.64,59.87 | v153.96,65.58 153.64,65.58 153.2,66.03 C11.2 IC6.4 149.2,66.53 146.98,64.31 v146.34,64.31 | v136.5,33.83 137.45,33.83 140.63,30.66 140.63,29.38 141.58,28.43 v143.8,28.43 | D1.2 150.25,35.51 151.1,36.37 157.77,36.37 159.99,38.59 v159.99,45.58 | C49.2 28.23,30.47 U1.8 28.23,26.53 27.91,26.21 | 27.91,26.21 C48.+ | 27.91,26.21 32.36,26.21 32.68,25.89 v35.22,25.89
  Bottom 0.381: v103.54,26.16 105.81,28.43 v106.34,28.43 | v132.69,75.74 132.69,68.44 133.59,67.53 U$93.1 133.59,65.63 133.96,65.26 137.13,65.26 138.09,64.31 v146.34,64.31 | v16.17,43.35 v18.07,43.35 | v26.96,43.35 29.01,45.4 v29.5,45.4 29.64,45.26 v33.39,45.26 | v39.03,44.31 v41.51,44.31 | v53.31,47.04 57,47.04 v57.12,47.16 | v55.54,51.29 54.85,51.98 U$111.3 54.35,52.48 v53.95,52.88 | v47.28,68.44 v47.28,70.98 | v54.34,42.03 53.76,41.45 53,41.45 v52.68,41.77 | U$70.3 57.08,33.88 57.44,33.51 v58.08,33.51 58.08,32.59 v56.79,31.3 | U$71.3 65.01,28.7 66.01,29.7 66.01,31.29 66.33,31.61 v66.33,34.47 66.41,34.55 U$112.3 68.59,33.2 v78.4,33.2 | v65.7,35.72 v65.7,37.02 | v65.06,40.05 63.52,40.05 v62.84,40.73 | v54.46,59.67 52.74,57.96 v51.97,57.96 | U$22.12V 36.49,13.19 v39.34,16.05 39.26,16.13 U$97.3 | v95.86,29.7 v97.46,29.7 | v120.31,32.24 120.31,30.66 119.35,29.7 v118.4,29.7 | v129.83,34.15 v129.83,36.05 | v129.83,38.91 131.09,40.17 v131.09,42.09 | v91.99,85.9 95.77,85.9 v96.54,86.67 | v96.71,93.42 97.45,94.16 v98.08,94.16 | v103.8,93.2 v103.8,91.93 | v104.11,81.77 v106.02,81.77 | v124.37,82.67 124.43,82.62 v124.43,81.45 | v125.49,76.06 125.81,75.74 v126.97,75.74 | v136.4,81.04 v138.82,83.46 | v154.6,50.66 152.69,52.56 v152.69,54.47 | v153.64,59.87 153.96,60.18 v153.96,65.58 | v134.59,33.83 v136.5,33.83 | v143.8,28.43 145.31,28.43 R50.P$3 | v159.99,45.58 155.23,45.58 v154.91,45.9 | v35.22,25.89 v39.29,25.89
-12V  (via drill 0.3)
  Top 0.381: C16.1 IC4.11 67.92,41.45 66.65,40.18 66.65,36.69 66.33,36.37 v58.08,36.37 | IC7.11 C43.1 100.81,85.08 101.57,84.31 v103.47,84.31 | C25.1 IC8.11 132.69,43.67 131.74,42.72 131.74,39.23 132.05,38.91 134.59,38.91 135.55,37.96 D2.1 | IC5.6 C14.1 52.42,36.43 v53.69,36.43 | IC3.11 C27.1 29.63,56.05 v30.27,56.05 | C10.1 IC2.11 57.71,61.77 v57.39,62.09 | IC6.11 C12.1 143.29,65.07 142.85,64.63 139.99,64.63 139.62,64.26 v139.62,63.04 | IC9.11 C31.1 155.03,55.09 v155.87,55.09 | IC10.6 C20.1 134.78,71.11 135.86,70.03 v135.86,68.12 | R59.1 130.78,64.94 | 130.78,64.94 131.42,64.31 | 131.42,64.31 133.32,64.31 134.28,65.26 134.28,66.53 v135.86,68.12 | v68.29,34.47 67.6,34.47 66,32.87 v62.2,32.87 | v31.56,56.65 32.79,56.65 v34.9,54.54 | v36.58,54.56 37.74,53.4 v38.28,53.4 | v40.63,53.53 41.25,54.15 49.82,54.15 v51.41,52.56 | v49.19,73.19 v49.19,70.98 | v49.19,69.12 51.73,66.58 v51.73,65.26 | v53.63,63.04 54.58,62.09 v55.59,62.09 55.22,61.72 v55.22,60.5 | v51.09,57.01 v51.09,55.37 | v55.66,38.27 55.66,40.67 v55.85,40.87 | v55.85,42.68 v55.85,45.26 | v78.4,34.47 84.43,34.47 87.6,31.29 95.54,31.29 96.81,30.02 96.81,26.21 99.67,23.35 U$41.P$1 99.67,22.08 100.62,21.13 110.78,21.13 111.73,22.08 111.73,24.94 112.37,25.57 114.59,25.57 114.91,25.89 114.91,26.53 116.81,28.43 v118.4,28.43 | D2.1 128.34,32.02 125.7,29.38 125.7,29.07 125.07,28.43 v122.21,28.43 | v106.46,84.31 106.46,83.24 106.65,83.04 112.71,83.04 112.73,83.07 113.27,83.07 113.3,83.04 113.64,83.04 113.96,82.72 v113.96,82.42 | v113.96,80.5 113.96,79.23 114.59,78.6 116.5,78.6 117.45,77.64 117.45,72.88 120.94,69.39 v123.8,69.39
  Top 0.381: v124.43,68.12 R56.2 124.88,66.53 126.97,66.53 127.29,66.22 v127.29,64.54 | v129.2,64.55 130.39,64.55 130.78,64.94 | IC11.11 C46.1 155.1,89.27 155.31,89.47 v155.87,89.47 | v135.86,68.12 135.86,67.17 137.77,65.26 v137.77,63.04 | v152.04,56.69 151.73,56.37 v145.71,56.37 | v141.9,56.37 135.55,56.37 135.23,56.69 v135.23,57.96 | v135.23,60.45 131.42,64.26 131.42,64.31 | v143.8,27.16 C4.- 139.8,28.3 C2.1 139.8,30.21 137.99,32.02 D2.1 | v151.1,28.79 151.1,34.78 151.74,35.42 158.41,35.42 160.95,37.96 160.95,42.4 162.22,43.67 164.44,43.67 165.39,44.62 165.39,52.42 165.35,52.47 165.35,53.24 163.49,55.1 v162.8,55.1 | v160.95,55.1 160.95,58.91 161.58,59.55 v161.58,65.26 | v156.18,87.45 156.22,87.49 156.18,87.49 162.85,80.82 162.85,76.69 160.31,74.15 v160.31,67.17
  Bottom 0.381: U$93.3 135.59,67.85 v135.86,68.12 | v58.08,36.37 53.76,36.37 v53.69,36.43 | v58.08,36.37 58.08,35.55 U$70.1 60.52,34.55 62.2,32.87 | v68.29,34.47 69.16,34.47 U$112.1 78.32,34.55 v78.4,34.47 | v30.27,56.05 30.96,56.05 v31.56,56.65 | v34.9,54.54 36.56,54.54 v36.58,54.56 | v38.28,53.4 40.5,53.4 v40.63,53.53 | U$111.1 54,49.98 v51.41,52.56 51.09,52.88 v51.09,55.37 55.59,55.37 59.03,51.93 59.03,50.02 58.71,49.7 58.71,47.48 57.44,46.21 56.81,46.21 v55.85,45.26 | v49.19,74.48 v49.19,73.19 | v49.19,70.98 v49.19,69.12 | v51.73,65.26 53.63,63.36 v53.63,63.04 | v55.59,62.09 v57.39,62.09 | U$71.1 64.37,30.7 62.2,32.87 | v51.09,57.01 51.09,58.28 53.31,60.5 v55.22,60.5 | v58.08,36.37 56.81,36.37 55.66,37.52 v55.66,38.27 | v55.85,40.87 v55.85,42.68 | v122.21,28.43 v118.4,28.43 | v103.47,84.31 v106.46,84.31 | v113.96,82.42 v113.96,80.5 | v123.8,69.39 124.43,68.75 v124.43,68.12 | v127.29,64.54 129.18,64.54 v129.2,64.55 | v137.77,63.04 v139.62,63.04 | v152.04,56.69 154.16,56.69 155.64,55.2 155.75,55.2 v155.87,55.09 155.88,55.1 v160.95,55.1 v162.8,55.1 | v145.71,56.37 v141.9,56.37 | v135.23,57.96 v135.23,60.45 | v143.8,27.16 149.48,27.16 v151.1,28.79 | v156.18,87.45 155.87,87.76 v155.87,89.47 | 62.2,32.87 v62.2,32.87 | v161.58,65.26 161.58,65.9 v160.31,67.17
ACID1:ACIDVI  (via drill 0.3)
  Top 0.254: ACID1:IC5.3 33.58,88.44 33.9,88.76 33.9,88.86 34.1,89.06 v36.73,89.06 37.62,89.06 ACID1:R72.1
  Top 0.381: ACID1:R25.1 27.6,89.08 28.23,88.44 ACID1:IC5.3
ACID1:N$3  (via drill 0.3)
  Top 0.254: ACID1:D1.CATHODE 17.12,90.98 19.66,90.98 19.99,90.65 ACID1:D2.ANODE 19.99,88.11 20.74,87.36 ACID1:C28.2 24.47,85.09 24.47,84.07 24.65,83.89 24.65,74.57 24.47,74.39 24.47,73.91 25.91,72.48 33.56,72.48 ACID1:R24.P$3 | ACID1:R22.P$3 40.3,30.18 40.3,33.51 38.16,35.65 38.16,38.42 40.7,40.96 40.7,44.41 v39.61,45.5 | v38.44,45.81 37.39,46.86 37.39,47.72 36.26,48.85 36.26,52.65 36.8,53.2 36.8,53.52 33.31,57.01 33.31,60.5 35.44,62.63 35.44,68.65 v34.97,69.12
  Bottom 0.254: v39.61,45.5 39.3,45.81 v38.44,45.81 | v34.97,69.12 35.26,69.41 ACID1:R24.P$3
ACID1:N$4
  Top 0.254: ACID1:IC5.4 30.08,85.45 ACID1:C24.1
ACID1:N$20
  Top 0.254: ACID1:R25.2 ACID1:C23.2
ACID1:N$22  (via drill 0.3)
  Top 0.254: ACID1:C26.2 27.28,90.98 28.55,89.71 | 28.55,89.71 28.87,89.71 | 28.87,89.71 ACID1:IC5.2 | ACID1:R27.1 31.91,85.58 32.31,85.98 32.31,86.73 31.25,87.79 v28.55,87.79 | v28.55,89.09 28.55,89.39 | 28.55,89.39 28.55,89.71 | 28.55,89.39 28.87,89.71
  Bottom 0.254: v28.55,87.79 v28.55,89.09
ACID1:N$23
  Top 0.254: ACID1:C26.1 ACID1:R26.1
ACID1:N$32
  Top 0.254: ACID1:C27.1 38.26,87.17 37.76,87.17 36.49,88.44 ACID1:IC5.6 34.58,88.44 33.44,87.3 ACID1:R27.2
ACID1:N$33  (via drill 0.3)
  Top 0.254: ACID1:R26.2 26.14,93.2 25.06,93.2 24.1,92.25 24.1,87.17 v25.06,86.22 | v25.06,84.31 v25.06,74.15 | v25.06,71.93 27.28,69.71 35.22,69.71 35.85,69.07 35.85,60.5 37.44,58.91 37.44,55.9 ACID1:R23.P$3
  Bottom 0.254: v25.06,86.22 v25.06,84.31 | v25.06,74.15 v25.06,71.93
ACID1:N$35
  Top 0.254: ACID1:C27.2 37.88,85.27 ACID1:R28.2
ACID1:N$36  (via drill 0.3)
  Top 0.254: ACID1:R22.P$1 36.21,31.09 36.8,31.09 ACID1:R22.P$2 37.76,38.59 40.3,41.13 40.3,43.99 39.03,45.26 39.03,53.48 v38.06,54.45 | ACID1:R28.1 35.22,85.14 v35.22,77.01 | v35.22,74.15 35.22,72.56 36.49,71.3 36.49,60.82 38.09,59.21 v38.09,56.07
  Bottom 0.254: v35.22,77.01 v35.22,74.15 | v38.09,56.07 38.09,54.48 v38.06,54.45
BIASINPUT  (via drill 0.3)
  Top 0.254: R61.2 132.88,41.77 v132.38,42.27 | v132.37,44.31 132.37,46.21 v132.74,46.58 | v137.13,52.88 140.94,52.88 141.26,53.2 141.9,53.2 142.53,53.83 142.53,59.36 v142.43,59.45 | v149.83,65.89 149.5,65.89 147.29,63.67 146.26,63.67 145.71,63.12 v145.71,62.09 | v149.83,67.18 149.83,67.8 148.56,69.07 148.56,71.12 v148.88,71.44 | v148.88,73.2 150.47,73.2 151.74,74.47 151.74,75.42 154.6,78.28 J23.TIP_B@1
  Bottom 0.254: v132.38,42.27 132.38,44.3 v132.37,44.31 | v132.74,46.58 132.74,48.49 v137.13,52.88 | v142.43,59.45 144.97,59.45 145.71,60.18 v145.71,62.09 | v149.83,65.89 v149.83,67.18 | v148.88,71.44 v148.88,73.2
BIASMAINLINE  (via drill 0.3)
  Top 0.254: IC8.8 134.7,41.77 R60.1 C32.1 136.69,35.61 v136.5,35.42 137.13,36.05 141.26,36.05 141.58,36.37 141.58,38.27 141.77,38.47 v143.85,38.47 | D6.ANODE 128.87,37.96 128.24,37.96 127.62,37.34 D4.ANODE 127.94,35.42 v134.59,35.42 | D8.ANODE 151.41,40.39 v151.25,40.55 150.88,40.18 v148.25,40.18 | v151.1,42.09 150.47,42.72 150.47,44.94 149.41,46 149.34,46 148.25,47.09 v148.25,47.8 | v147.37,53.59 147.85,53.59 147.94,53.5 D10.ANODE 148.56,52.88 150.79,55.1 v152.04,55.1 | v163.34,53.47 163.55,53.47 D9.ANODE
  Bottom 0.254: v136.5,35.42 v134.59,35.42 | v151.25,40.55 151.25,41.94 v151.1,42.09 | v148.25,47.8 148.25,50.66 147.29,51.61 147.29,53.52 v147.37,53.59 | v143.85,38.47 146.53,38.47 v148.25,40.18 | v152.04,55.1 153.01,55.1 153.96,54.15 162.66,54.15 v163.34,53.47
CLIP1:CLIPVI
  Top 0.254: CLIP1:R34.1 CLIP1:C29.2
  Top 0.381: CLIP1:C29.2 60.43,87.55 CLIP1:R33.1
CLIP1:N$1  (via drill 0.3)
  Top 0.254: CLIP1:IC6.6 69.82,86.53 70.62,85.74 | CLIP1:C31.2 70.65,85.71 70.62,85.74 | v74.69,90.13 74.36,90.47 74.36,94.22 73.32,95.26 CLIP1:C1.+ | v72.25,86.17 71.04,86.17 70.62,85.74 | CLIP1:R31.P$2 CLIP1:R31.P$3 | v68.24,50.34 73.23,50.34 74.81,51.93 74.81,64.08 v73.63,65.26 | v73.76,66.53 73.76,67.36 69.45,71.66 v67.92,71.66
  Bottom 0.254: v74.69,90.13 72.63,88.07 72.63,87.88 72.25,87.5 v72.25,86.17 73,85.42 73,82.69 72.95,82.64 72.95,82.08 73.4,81.62 73.4,78.7 74.22,77.89 74.22,77.4 72.92,76.11 70.92,76.11 69.27,74.46 68.99,74.46 67.92,73.39 v67.92,71.66 | CLIP1:R31.P$3 68.28,50.3 v68.24,50.34 | v73.63,65.26 73.63,66.41 v73.76,66.53
CLIP1:N$3
  Top 0.254: CLIP1:C4.1 60.43,84.05 61.64,85.27 CLIP1:IC6.4
CLIP1:N$38
  Top 0.254: CLIP1:IC6.3 61.69,86.53 CLIP1:C30.2 58.9,86.79 CLIP1:R33.2
CLIP1:N$42  (via drill 0.3)
  Top 0.254: CLIP1:R35.2 73.32,87.93 73.32,86.41 CLIP1:C31.1 72.17,84.5 v72.36,84.31 | CLIP1:R35.2 CLIP1:R36.2 | CLIP1:IC6.2 v65.7,87.81 | v68.24,89.83 71.42,89.83 CLIP1:R35.2 | v65.7,48.44 74.59,48.44 75.22,49.07 v75.22,64.94 | v74.9,70.98 73.43,72.45 v73.43,72.58 | v73,75.11 73,77.01 v73.63,77.64
  Bottom 0.254: v65.7,87.81 67.72,89.83 v68.24,89.83 | v75.22,64.94 74.9,64.94 74.27,65.58 74.27,65.9 74.9,66.53 v74.9,70.98 | v73.43,72.58 73,73.01 v73,75.11 | v73.63,77.64 73,78.28 73,81.45 72.36,82.09 v72.36,84.31 | v65.7,48.44 63.2,45.94 CLIP1:R31.P$1
CLIP1:N$44  (via drill 0.3)
  Top 0.254: CLIP1:R37.1 71.6,82.41 72.51,82.41 73.14,83.04 73.14,83.98 74.9,85.74 v74.9,87.49 | v74.59,99.87 73.32,101.14 CLIP1:C1.-
  Bottom 0.254: v74.9,87.49 74.9,89.08 75.54,89.71 75.54,96.06 74.59,97.01 v74.59,99.87
CLIP1:N$45
  Top 0.254: CLIP1:R30.P$1 CLIP1:R30.P$2 64.62,23.99 66.97,23.99 77.13,34.15 77.13,65.9 69.82,73.2 69.82,77.01 68.55,78.28 67.6,78.28 66.01,79.87 66.01,81.14 64.11,83.05 CLIP1:D1.CATHODE 64.76,84.01 CLIP1:D2.ANODE 67.93,84.01 68.24,84.31 71.22,84.31 CLIP1:R37.2
CLIP1:N$46  (via drill 0.3)
  Top 0.254: v69.82,77.96 70.46,77.33 70.46,73.52 77.76,66.22 77.76,33.83 66.45,22.52 CLIP1:R30.P$3 | v69.75,83.18 69.17,83.18 CLIP1:R38.1
  Bottom 0.254: v69.82,77.96 69.82,83.11 v69.75,83.18
CLIP1:N$47  (via drill 0.3)
  Top 0.254: v56.17,86.85 54.29,84.97 CLIP1:C2.+ | v57.44,86.85 58.08,87.49 58.08,87.81 58.35,88.08 v58.98,88.08 | v69.51,90.66 70.33,90.66 CLIP1:R36.1
  Bottom 0.254: v56.17,86.85 v57.44,86.85 | v58.98,88.08 64.7,88.08 67.28,90.66 v69.51,90.66
CLIP1:N$48  (via drill 0.3)
  Top 0.254: CLIP1:C3.+ 55.24,76.72 v60.93,82.41 | v70.53,88.2 70.65,88.31 CLIP1:R35.1
  Bottom 0.254: v60.93,82.41 64.74,82.41 v70.53,88.2
CLIP1:N$49
  Top 0.254: CLIP1:C35.1 CLIP1:C36.1 71.22,80.5 70.14,80.5 69.51,81.14 69.19,81.14 68.87,81.45 CLIP1:R38.2
CLIP1:N$50  (via drill 0.3)
  Top 0.254: CLIP1:R39.2 67.92,81.26 v67.92,82.09 67.92,82.41 68.24,82.72 69.38,82.72 CLIP1:C36.2 | v71.09,92.25 70.31,93.03 CLIP1:Q1.3
  Bottom 0.254: v67.92,82.09 67.92,82.41 71.41,85.9 71.41,91.93 v71.09,92.25
CLIP1:N$51
  Top 0.254: CLIP1:R40.2 68.36,93.33 69.51,94.47 70.46,94.47 CLIP1:Q1.2 73.95,93.03 73.95,90.05 CLIP1:C28.+
CLIP1:N$52  (via drill 0.3)
  Top 0.254: CLIP1:R29.P$3 65.74,73.19 v66.01,73.47 | v66.01,74.64 66.01,76.69 66.65,77.33 68.68,77.33 v68.77,77.23 | v73.54,82.4 73,81.86 73,77.96 72.36,77.33 v71.09,77.33 | v76.81,89.47 76.49,89.78 CLIP1:C28.-
  Bottom 0.254: v66.01,73.47 v66.01,74.64 | v68.77,77.23 68.87,77.33 v71.09,77.33 | v73.54,82.4 v73.54,82.41 75.54,82.41 76.81,83.68 v76.81,89.47
CREAM1:N$1
  Top 0.254: CREAM1:R47.2 CREAM1:C28.-
CREAM1:N$61
  Top 0.254: CREAM1:C28.+ 107.8,50.51 CREAM1:R48.2 107.48,54.47 CREAM1:T1.B 101.57,54.47 101.38,54.66 CREAM1:R49.2 CREAM1:C44.1
CREAM1:N$62
  Top 0.254: CREAM1:R50.1 105.53,56.05 CREAM1:T1.E
CREAM1:N$63  (via drill 0.3)
  Top 0.254: CREAM1:R51.2 CREAM1:C44.2 CREAM1:R49.1 102.25,56.18 CREAM1:T1.C 106.65,55.42 106.97,55.1 108.24,55.1 108.56,54.78 108.56,50.34 v109.19,49.7 | v109.19,47.53 109.24,47.48 111.42,47.48 111.73,47.16 v111.73,41.13 | v113,41.13 v115.86,41.13 | v117.13,40.81 118.91,40.81 CREAM1:C45.1
  Bottom 0.254: v109.19,49.7 v109.19,47.53 | v111.73,41.13 v113,41.13 | v115.86,41.13 116.18,40.81 v117.13,40.81
CREAM1:N$64
  Top 0.254: CREAM1:R71.P$3 119.08,42.25 CREAM1:C45.2
CREAM1:N$65
  Top 0.254: CREAM1:R54.2 107.48,59.55 CREAM1:T2.B 105.21,59.19 CREAM1:R53.2 103.48,58.47 CREAM1:R56.2 CREAM1:C47.1 95.67,58.47 93.95,60.18 86.65,60.18 85.38,58.91 CREAM1:C1.-
CREAM1:N$66
  Top 0.254: CREAM1:D2.CATHODE CREAM1:D1.ANODE 91.08,52.24 89.83,52.24 88.58,51 CREAM1:C1.+
CREAM1:N$67
  Top 0.254: CREAM1:R55.2 107.48,61.45 CREAM1:T2.E
CREAM1:N$68  (via drill 0.3)
  Top 0.254: CREAM1:C47.2 96.62,60.12 CREAM1:R57.2 | CREAM1:C47.2 98.14,59.99 CREAM1:C49.1 98.65,59.99 CREAM1:R56.1 100.81,60.5 CREAM1:T2.C | CREAM1:D1.CATHODE CREAM1:D2.ANODE 93.01,54.15 93.95,54.15 95.54,55.74 v95.54,57.33 | CREAM1:C47.2 95.73,59.99 v95.54,60.18
  Bottom 0.254: v95.54,60.18 v95.54,57.33
CREAM1:N$69
  Top 0.254: CREAM1:C49.2 101.57,61.26 CREAM1:R58.1
CREAM1:N$70  (via drill 0.3)
  Top 0.254: CREAM1:C50.1 105.51,68.14 CREAM1:T3.B 104.75,68.44 v104.11,67.8 | CREAM1:C50.1 CREAM1:R58.2 CREAM1:R59.2 | CREAM1:C50.1 106.78,67.48 CREAM1:R61.2 | v101.89,67.8 101.57,68.12 101.57,72.86 CREAM1:C2.-
  Bottom 0.254: v104.11,67.8 v101.89,67.8
CREAM1:N$71
  Top 0.254: CREAM1:R60.2 106.85,70.34 CREAM1:T3.E
CREAM1:N$72  (via drill 0.3)
  Top 0.254: CREAM1:R63.1 CREAM1:C52.1 103.01,70.96 CREAM1:T3.C 103.01,67.19 CREAM1:C50.2 | CREAM1:C50.2 101.25,66.22 CREAM1:D4.CATHODE CREAM1:D3.ANODE | CREAM1:R61.1 109.32,65.64 CREAM1:R62.2 107.29,65.58 v106.65,66.22 | v104.71,66.89 104.71,66.5 104.43,66.22 CREAM1:C50.2
  Bottom 0.254: v106.65,66.22 105.38,66.22 v104.71,66.89
CREAM1:N$73  (via drill 0.3)
  Top 0.254: CREAM1:C53.1 112.05,75.93 112.05,73.2 113,72.25 113,56.05 v114.91,54.15 | CREAM1:R70.P$2 119.04,30.02 v112.37,36.69 | v112.37,39.55 112.37,49.39 v114.91,51.93
  Bottom 0.254: v112.37,36.69 v112.37,39.55 | v114.91,51.93 v114.91,54.15
CREAM1:N$74  (via drill 0.3)
  Top 0.254: CREAM1:R63.2 CREAM1:C55.2 107.8,74.34 107.92,74.47 107.94,74.46 v108.47,74.46 | CREAM1:R70.P$1 116.54,27.19 v117.13,27.79 | v117.13,30.35 117.13,30.97 113.64,34.47 112.37,34.47 109.51,37.32 v104.75,37.32 | v104.75,38.59 105.7,38.59 106.02,38.91 106.02,46.85 v105.38,47.48 | v105.38,49.7 106.02,50.34 106.02,53.52 106.34,53.83 v106.37,53.83 | v109.19,53.2 109.83,53.2 110.15,53.52 110.15,57.13 v110.05,57.22 | v110.88,58.06 110.88,64.09 111.73,64.94 111.73,72.69 v111.56,72.87
  Bottom 0.254: v117.13,27.79 v117.13,30.35 | v104.75,37.32 v104.75,38.59 | v105.38,47.48 v105.38,49.7 | v106.37,53.83 108.56,53.83 v109.19,53.2 | v110.05,57.22 110.88,58.05 v110.88,58.06 | v111.56,72.87 109.97,74.46 v108.47,74.46
CREAM1:N$75  (via drill 0.3)
  Top 0.254: CREAM1:C52.2 CREAM1:R64.1 107.8,71.74 v108.56,70.98 | CREAM1:R70.P$3 121.62,28.39 v119.04,30.97 | v116.5,34.78 116.5,42.72 115.23,43.99 115.23,50.98 v115.54,51.29 | v115.54,54.78 113.64,56.69 v113.64,67.48
  Bottom 0.254: v119.04,30.97 116.5,33.51 v116.5,34.78 | v115.54,51.29 v115.54,54.78 | v113.64,67.48 110.15,70.98 v108.56,70.98
CREAM1:N$76
  Top 0.254: CREAM1:D4.ANODE CREAM1:D3.CATHODE 98.72,71.31 CREAM1:C2.+
CREAM1:N$77
  Top 0.254: CREAM1:T4.B 110.33,78.28 CREAM1:R65.2 CREAM1:C53.2 CREAM1:R66.1
CREAM1:N$78
  Top 0.254: CREAM1:T4.C 105.07,77.79 CREAM1:R67.1 CREAM1:C54.1
CREAM1:N$79
  Top 0.254: CREAM1:R68.2 109.02,79.87 CREAM1:T4.E
CREAM1:N$80  (via drill 0.3)
  Top 0.254: CREAM1:R69.P$3 120.82,68.24 116.81,72.25 116.81,77.33 116.18,77.96 v113.64,77.96 | v110.07,77.01 103.8,77.01 103.48,76.69 CREAM1:C54.2
  Bottom 0.254: v113.64,77.96 112.69,77.01 v110.07,77.01
CREAM1:N$84
  Top 0.254: CREAM1:R71.P$1 113.96,44.07 CREAM1:R52.1
CREAM1:N$85
  Top 0.254: CREAM1:C46.2 CREAM1:R53.1
CREAM1:N$86
  Top 0.254: CREAM1:C46.1 110.15,57.96 116.5,51.61 CREAM1:R71.P$2
CROSSFADER_OUT  (via drill 0.3)  (1 unrouted)
  Top 0.254: R110.1 146.53,61.64 146.5,61.61 | 146.5,61.61 146.34,61.45 145.39,61.45 145.07,61.77 145.07,64.33 IC6.14 | 146.5,61.61 146.66,61.45 148.56,61.45 148.88,61.77 149.66,61.77 150.15,61.28 150.15,59.95 150.47,59.64 151.64,59.64 v151.96,59.96 | v154.7,59.13 156.92,59.13 160.31,55.74 160.31,54.47 161.26,53.52 v161.59,53.52 | v167.61,50.34 168.57,50.34 169.52,49.39
  Bottom 0.254: v151.96,59.96 152.69,59.23 154.6,59.23 v154.7,59.13 | v161.59,53.52 162.21,53.52 165.39,50.34 v167.61,50.34
CV_IN  (via drill 0.3)
  Top 0.254: J25.TIP_T@3 174.92,46.85 174.28,47.48 172.69,47.48 171.74,48.44 171.74,49.7 173.96,51.93 173.96,54.15 172.06,56.05 167.93,56.05 167.61,56.37 v167.61,59.87 | R112.2 141.77,69.52 141.9,69.39 v142.71,69.39 | v145.34,70.03 147.15,68.21 v147.15,66.67 | v147.29,60.23 148.88,58.65 v152.04,58.65 | v153.34,58.59 154.61,59.87 v160.62,59.87
  Bottom 0.254: v142.71,69.39 143.8,69.39 144.44,70.03 v145.34,70.03 | v147.15,66.67 147.15,60.37 v147.29,60.23 | v152.04,58.65 153.29,58.65 v153.34,58.59 | v160.62,59.87 v167.61,59.87
ENVELOPE_OUT  (via drill 0.3)
  Top 0.254: v148.88,88.12 148.9,88.11 IC11.10 154.53,88.11 154.61,88.03 156.59,88.03 157.14,87.49 166.34,87.49 168.51,85.32 168.51,78.34 J1.SWITCH_T@3 | v143.85,87.86 125.02,87.86 122.85,90.03 v108.56,90.03 | v108.46,95.52 103.7,95.52 96.39,102.83 v86.33,102.83 | J24.TIP_T@3 9.44,34.15 v18.39,34.15 19.34,35.1 v19.34,40.18 | v23.15,34.15 25.06,32.24 v26.33,32.24 | v28.87,32.24 30.64,32.24 R126.1 | v19.49,41.81 v20.39,42.71 | v22.45,44.77 22.83,45.15 v22.83,46.85 | v28.87,50.42 30.63,52.18 v30.63,52.51
  Bottom 0.254: v148.88,88.12 144.12,88.12 v143.85,87.86 | v108.56,90.03 108.56,95.42 v108.46,95.52 | v86.33,102.83 86.06,102.83 84.19,100.96 61.55,100.96 59.33,103.19 49.84,103.19 47.62,100.96 40.3,100.96 36.17,96.83 36.17,95.11 34.17,93.11 34.17,92.16 29.01,86.99 29.01,86.04 27.82,84.86 27.82,83.51 30.36,80.97 30.36,72.08 31.24,71.21 31.24,70.18 32.9,68.52 32.9,52.56 32.68,52.33 30.81,52.33 v30.63,52.51 | v18.39,34.15 v23.15,34.15 | v26.33,32.24 v28.87,32.24 | v19.34,40.18 19.34,41.65 v19.49,41.81 | v20.39,42.71 v22.45,44.77 | v28.87,50.42 28.81,50.37 28.81,49.01 26.66,46.85 v22.83,46.85
EURORACK_IN  (via drill 0.3)
  Top 0.254: R34.1 31.41,39.86 29.18,37.64 29.18,36.37 28.87,36.05 24.42,36.05 23.15,37.32 v23.15,42.71 | v23.47,45.9 v23.47,54.78 | v23.47,57.29 23.47,57.96 22.52,58.91 7.91,58.91 7.28,58.28 J20.TIP_B@1
  Bottom 0.254: v23.15,42.71 23.47,43.02 v23.47,45.9 | v23.47,54.78 v23.47,57.29
FUZZ1:N$53  (via drill 0.3)
  Top 0.254: v74.9,79.23 74.44,78.75 FUZZ1:Q2.E | FUZZ1:R41.1 80.11,85.58 84.43,85.58 85.38,84.63 85.38,79.55 v86.02,78.92 | FUZZ1:R43.P$3 91.89,34.47 90.46,34.47 89.51,35.42 88.56,35.42 88.24,35.73 v88.24,37.32 | v88.24,39.24 88.24,41.45 87.92,41.77 85.7,41.77 85.06,42.4 v85.06,47.48 | v82.89,51.29 82.84,51.34 v82.84,62.72 | v85.38,63.36 88.11,63.36 v88.29,63.53 | v90.68,63.36 90.68,67 v90.46,67.22 | v90.46,79.55 89.19,80.82 v86.65,80.82 | v78.08,77.01 v85.06,77.01
  Bottom 0.254: v78.08,77.01 77.13,77.01 v74.9,79.23 | v85.06,77.01 86.02,77.96 v86.02,78.92 86.65,79.55 v86.65,80.82 | v88.24,37.32 v88.24,39.24 | v85.06,47.48 85.06,49.7 83.48,51.29 v82.89,51.29 | v82.84,62.72 84.75,62.72 v85.38,63.36 | v88.29,63.53 90.5,63.53 v90.68,63.36 | v90.46,67.22 v90.46,79.55
FUZZ1:N$54
  Top 0.254: FUZZ1:Q1.B 77.13,82.41 77.67,82.95 81.98,82.95 80.94,84 80.94,84.31 80.3,84.95 79.22,84.95 FUZZ1:R41.2 78.27,87.34 FUZZ1:C28.-
FUZZ1:N$55  (via drill 0.3)
  Top 0.254: FUZZ1:R45.2 77.63,83.36 FUZZ1:Q1.C FUZZ1:Q2.B 74.9,80.5 v75.54,81.14
  Bottom 0.254: v79.67,81.14 v75.54,81.14
FUZZ1:N$56  (via drill 0.3)
  Top 0.254: FUZZ1:C1.- 76.79,76.38 v79.67,76.38 | v83.48,66.22 v83.48,64.63 | v83.48,63.36 83.48,49.83 v83.35,49.7 | v83.48,46.85 81.57,44.94 81.57,41.45 81.94,41.08 v82.52,41.08 | v82.71,37.32 82.71,36.19 v83.79,35.11
  Bottom 0.254: v83.48,66.22 83.48,67.8 79.67,71.61 79.67,73.2 81.24,74.78 81.24,74.86 81.25,74.87 81.25,75.42 80.3,76.38 v79.67,76.38 | v83.48,64.63 v83.48,63.36 | v83.35,49.7 83.35,46.97 v83.48,46.85 | v82.52,41.08 82.52,37.51 v82.71,37.32 | v83.79,35.11 v83.81,35.1 90.58,35.1 91.1,34.59 FUZZ1:R43.P$2
FUZZ1:N$57  (via drill 0.3)
  Top 0.254: v93.64,61.47 93.01,62.09 89.83,62.09 89.51,62.41 89.51,66.98 v89.6,67.07 | v89.51,79.55 87.92,79.55 86.65,78.28 v85.06,78.28 | v83.16,78.28 81.01,78.28 80.29,77.56 79.3,77.56 78.57,78.28 FUZZ1:C42.2
  Bottom 0.254: FUZZ1:R42.P$3 93.68,61.42 v93.64,61.47 | v89.6,67.07 89.6,79.45 v89.51,79.55 | v85.06,78.28 v83.16,78.28
FUZZ1:N$58
  Top 0.254: FUZZ1:C42.1 FUZZ1:R44.1 78.27,81.71 FUZZ1:R46.2
FUZZ1:N$59
  Top 0.254: FUZZ1:R44.2 77.63,79.55 FUZZ1:Q2.C
GND  (via drill 0.3)